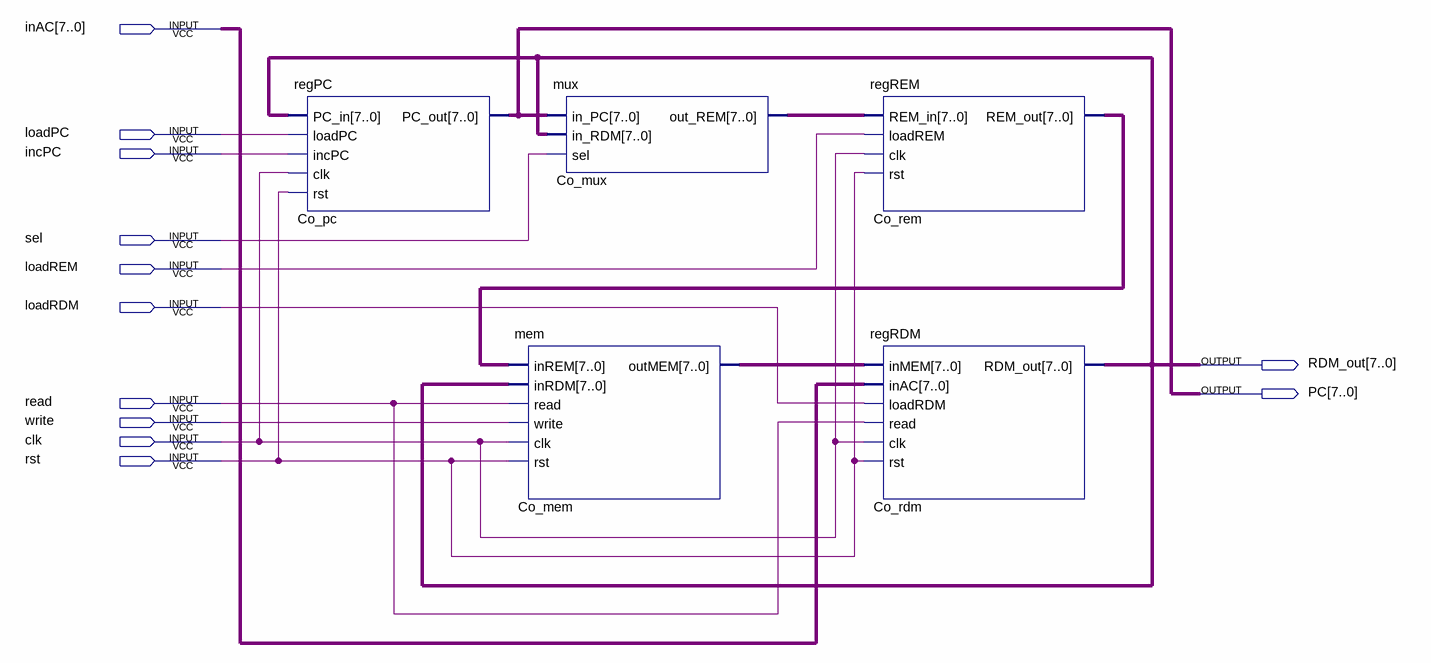
[diagram p0: schematic sheet]
// Quartus schematic mega_mem.bdf as structural Verilog: 5 symbols, 12 pins
module mega_mem (
  input  [7:0] inAC,
  input  loadPC,
  input  incPC,
  input  sel,
  input  loadREM,
  input  loadRDM,
  input  read,
  input  write,
  input  clk,
  input  rst,
  output [7:0] RDM_out,
  output [7:0] PC
);

  wire [7:0] Co_mem_outmem, Co_mux_out_rem, Co_rem_rem_out;

  regPC Co_pc (.PC_in(RDM_out), .loadPC(loadPC), .incPC(incPC), .clk(clk), .rst(rst), .PC_out(PC));
  mux Co_mux (.in_PC(PC), .in_RDM(RDM_out), .sel(sel), .out_REM(Co_mux_out_rem));
  mem Co_mem (
    .inREM(Co_rem_rem_out), .inRDM(RDM_out), .read(read), .write(write), .clk(clk), .rst(rst),
    .outMEM(Co_mem_outmem));
  regREM Co_rem (.REM_in(Co_mux_out_rem), .loadREM(loadREM), .clk(clk), .rst(rst), .REM_out(Co_rem_rem_out));
  regRDM Co_rdm (
    .inMEM(Co_mem_outmem), .inAC(inAC), .loadRDM(loadRDM), .read(read), .clk(clk), .rst(rst),
    .RDM_out(RDM_out));
endmodule
